# Altium schematic sheet SCH2-USB-isolator.SchDoc
size A4
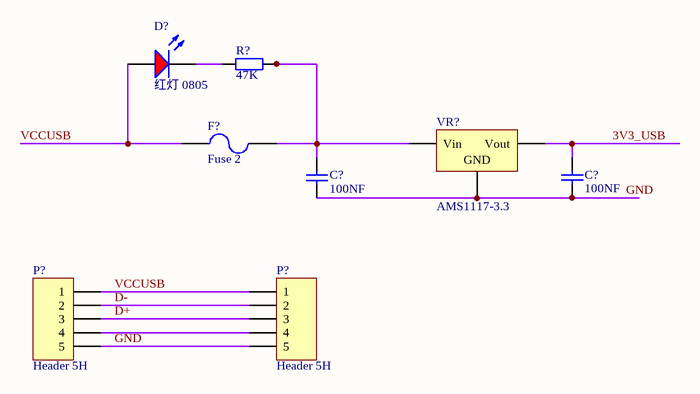
[diagram p0: SCH2-USB-isolator.SchDoc]

## Parts
(Parts that share a designator on the sheet are numbered #1, #2 ... from top to bottom, then left to right.)
C?#1  100NF  [0603_C]
C?#2  100NF  [0603_C]
D?  红灯 0805  [0805_LED_S1]
F?  Fuse 2  [FUSES]
P?#1  Header 5H  [HDR1X5H]
P?#2  Header 5H  [HDR1X5H]
R?  47K  [0805_R]
VR?  AMS1117-3.3  [SOT-223]

## Nets
3V3_USB: C?#2.2 VR?.2(Vout)
D+: P?#1.3 P?#2.3
D-: P?#1.2 P?#2.2
GND: C?#1.1 C?#2.1 P?#1.5 P?#2.5 VR?.1(GND)
VCCUSB: D?.A F?.1 P?#1.1 P?#2.1
NetC?#1_2: C?#1.2 F?.2 R?.2 VR?.3(Vin)
NetD?_K: D?.K R?.1
NetP?#1_4: P?#1.4 P?#2.4

## Notes on the sheet
- Title
- Size:
- Date:
- File:
- E
- Number:
- Time:
- Revision:
- Sheet
- of

## Library data of the parts
C?#1 C?#2 = Cap: 0603贴片电容; Published: 8-Jun-2000; LatestRevisionDate: 17-Jul-2002; LatestRevisionNote: Re-released for DXP Platform.; PackageReference: RAD-0.3; Publisher: Altium Limited; PackageDescription: Radial Cap, Thru-Hole; 2 Leads; 0.3 in Pin Spacing
D? = 0805 红灯: 发光二极管; ComponentLink1Description: 供应商链接; ComponentLink1URL: http://www.szlcsc.com/product/details_2668.html; Package: 0805; Supplier: LC; SuppliersPartNumber: C2295
F? = Fuse 2: Fuse; Published: 8-Jun-2000; LatestRevisionDate: 17-Jul-2002; LatestRevisionNote: Re-released for DXP Platform.; PackageReference: PIN-W2/E2.8; Publisher: Altium Limited; PackageDescription: Thru-Hole; 2 Leads
P?#1 P?#2 = Header 5H: Header, 5-Pin, Right Angle; LatestRevisionDate: 17-Jul-2002; LatestRevisionNote: Re-released for DXP Platform.; Publisher: Altium Limited
R? = Res2: 0805贴片电阻; Published: 8-Jun-2000; LatestRevisionDate: 17-Jul-2002; LatestRevisionNote: Re-released for DXP Platform.; PackageReference: AXIAL-0.4; Publisher: Altium Limited; PackageDescription: Axial Device, Thru-Hole; 2 Leads; 0.4 in Pin Spacing
VR? = SOT-223 AMS1117-3.3: 低压差线性稳压(LDO); ComponentLink1Description: 供应商链接; ComponentLink1URL: http://www.szlcsc.com/product/details_6652.html; Package: SOT-223; Supplier: LC; SuppliersPartNumber: C6186